# Altium schematic sheet Power.SchDoc
size A; SheetNumber: 2; SheetTotal: 3
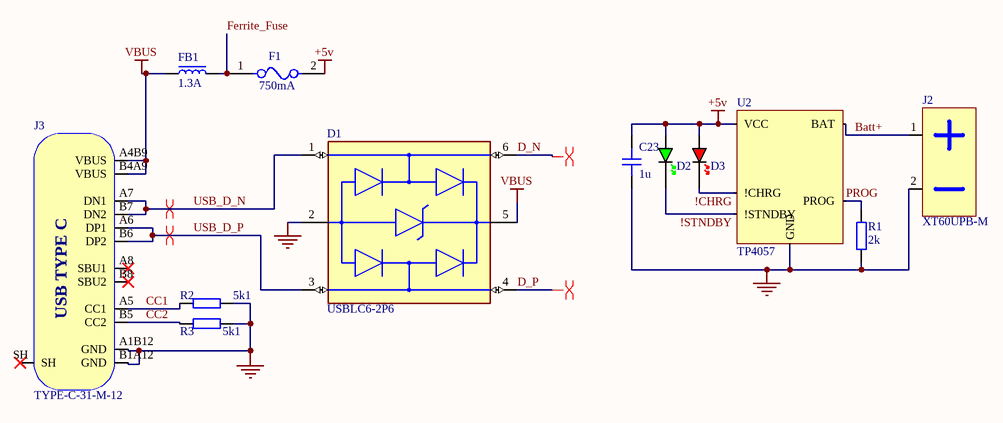
[diagram p0: Power.SchDoc]

## Parts
C23  1u  [CAP_0402]
D1  USBLC6-2P6  [FP-SOT-666-MFG]
D2  GREEN  [LED_0603_GREEN]  (value not drawn)
D3  RED  [LED_0603_RED]  (value not drawn)
F1  750mA  [FP-SF-0603S-MFG]
FB1  1.3A  [FB_0402]
J2  XT60UPB-M  [XT60UPB-M]
J3  TYPE-C-31-M-12  [TYPE-C-31-M-12]
R1  2k  [RES_0402]
R2  5k1  [RES_0402]
R3  5k1  [RES_0402]
U2  TP4057  [SOT23-6]

## Nets
+5v: C23.2 D2.A D3.A F1.2 U2.4(VCC)
GND: C23.1 D1.2(GND) J2.2(V-) J3.A1B12(GND) J3.B1A12(GND) R1.1 R2.2 R3.2 U2.2(GND)
VBUS: D1.5(VBUS) FB1.1 J3.A4B9(VBUS) J3.B4A9(VBUS)
!CHRG: D3.K U2.1(!CHRG)
!STNDBY: D2.K U2.5(!STNDBY)
Batt+: J2.1(V+) U2.3(BAT)
CC1: J3.A5(CC1) R2.1
CC2: J3.B5(CC2) R3.1
D_N: D1.6(I/O1)
D_P: D1.4(I/O2)
Ferrite_Fuse: F1.1 FB1.2
PROG: R1.2 U2.6(PROG)
USB_D_N: D1.1(I/O1) J3.A7(DN1) J3.B7(DN2)
USB_D_P: D1.3(I/O2) J3.A6(DP1) J3.B6(DP2)

Not connected (* = marked no-connect by the designer): J3 A8(SBU1)* B8(SBU2)* SH*

## Layout directives
differential pair: D_N, D_P, USB_D_N, USB_D_P

## Notes on the sheet
- (in symbol TYPE-C-31-M-12) USB TYPE C

## Library data of the parts
C23 = CAP_0402_25V
D1 = CMP-12225-000058-1: TVS DIODE 5.25V 17V SOT666; Min Breakdown Voltage: 6V; Power Line Protection: Yes; Element Configuration: Dual; Test Current: 1mA; Working Voltage: 5V; Number of Channels: 2; Max Reverse Leakage Current: 150nA; Direction: Unidirectional; Peak Pulse Current: 5A; Number of Elements: 1; Capacitance: 3.5pF; Max Breakdown Voltage: 6V; Height: 0.6mm; Depth: 1.3mm; Contact Plating: Tin; Reverse Breakdown Voltage: 6V; REACH SVHC: No SVHC; Operating Supply Voltage: 5V; Width: 1.3mm; Max Operating Temperature: 125°C; Reverse Standoff Voltage: 5V; ESD Protection: Yes; Package Quantity: 1; Termination: SMD/SMT; Length: 1.7mm; Leakage Current: 150nA; Number of Bidirectional Channels: 2; Case/Package: SOT-666; Min Operating Temperature: -40°C; Number of Pins: 6; Clamping Voltage: 17V; Breakdown Voltage: 6V; Lead Free: Lead Free; Radiation Hardening: No; Packaging: Tape and Reel; Mount: Surface Mount; Polarity: Unidirectional
D2 = LED_0603_GREEN: LED 0603 GREEN SMD
D3 = LED_0603_RED: LED 0603 RED SMD
F1 = CMP-07399-000004-1: FUSE BOARD MNT 500MA 50VDC 0603; Manufacturer: Bourns Inc.; Manufacturer Part Number: SF-0603S050-2; Fuse I2T: 0.009A2Sec; Fuse Current: 0.5A; Fuse Interrupt Ac Current: 50A; Max Fuse Ac Voltage: 35V; Resistance: 232mΩ; Fuse Blow Speed: Slow; Value: 232mΩ; Max Fuse Dc Voltage: 50V; Automotive: No; Category: Fuse; Temperature Range High: +105°C; Device Class L1: Circuit Protection; Height: 0.55mm; RoHS: TRUE; ComponentLink2URL: https://www.bourns.com/docs/product-datasheets/sf0603s.pdf; Ipc Land Pattern Name: CAPC16080X45; Temperature Range Low: -20°C; Mouser Description: Surface Mount Fuses 0.50A Slow Blow SinglFuse; Package: SF-0603S; Device Class L3: unset; Digikey Description: FUSE BOARD MNT 500MA 50VDC 0603; Device Class L2: Fuses; Lead Free: Yes; Temperature: -20°C to +105°C; ComponentLink2Description: Datasheet; Octopart: https://octopart.com/sf-0603s050-2-bourns-10486821; Fuse Interrupt Dc Current: 50A
FB1 = FB_0402: Ferrite Bead SMD 0402
J2 = XT60UPB-M: XT60 vertical male 2-pin AMASS; Manufacturer: AMASS; Manufacturer Part Number: XT60UPB-M
J3 = TYPE-C-31-M-12: USB Type C Connector Horizontal SMT; Manufacturer: Koren Hroparts; Manufacturer Part Number: TYPE-C-31-M-12
R1-R3 = RES_0402: Resistor SMD 0402